# Altium schematic sheet midi_5_pin_to_uart.SchDoc
size A
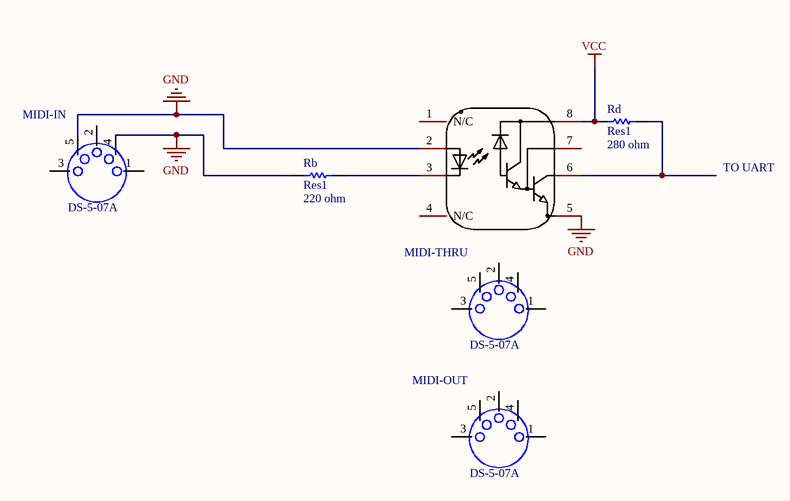
[diagram p0: midi_5_pin_to_uart.SchDoc]

## Parts
MIDI-IN  DS-5-07A
MIDI-OUT  DS-5-07A
MIDI-THRU  DS-5-07A
Rb  Res1  value 220 ohm  [AXIAL-0.3]
Rd  Res1  value 280 ohm  [AXIAL-0.3]
U??  6N138  [DIP-8_L9.8-W6.6-P2.54-LS7.6-BL]  (value not drawn)

## Nets
GND: Rb.1 U??.2(A) U??.5(GND)
VCC: Rd.1 U??.8(VCC)
NetRb_2: Rb.2 U??.3(C)
NetRd_2: Rd.2 U??.6(VOUT)

Not connected (* = marked no-connect by the designer): MIDI-IN 1(PIN-1) 2(PIN-2) 3(PIN-3) 4(PIN-4) 5(PIN-5); MIDI-OUT 1(PIN-1) 2(PIN-2) 3(PIN-3) 4(PIN-4) 5(PIN-5); MIDI-THRU 1(PIN-1) 2(PIN-2) 3(PIN-3) 4(PIN-4) 5(PIN-5); U?? 1(N/C) 4(N/C) 7(VB)

## Notes on the sheet
- TO UART

## Library data of the parts
MIDI-IN MIDI-OUT MIDI-THRU = DS-5-07A: MIDI 5-PIN
Rb Rd = Res1: Resistor; Published: 8-Jun-2000; LatestRevisionDate: 17-Jul-2002; LatestRevisionNote: Re-released for DXP Platform.; PackageReference: AXIAL-0.3; Publisher: Altium Limited; PackageDescription: Axial Device, Thru-Hole; 2 Leads; 0.3 in Pin Spacing
U?? = 6N138: Manufacturer: ISOCOM(英国安数光); Add into BOM: yes; Symbol: 6N138; Device: 6N138; LCSC Part Name: 6N138; Supplier Part: C255743; Manufacturer Part: 6N138; Supplier Footprint: DIP-8; JLCPCB Part Class: Extended Part; Datasheet: https://atta.szlcsc.com/upload/public/pdf/source/20180822/C255743_18671C8E554C080D6DA42199C3C846EF.pdf; Supplier: LCSC; Convert to PCB: yes